# Altium schematic sheet SmartToy_FirstPage Board_REV01.SchDoc: Smart Toy First Page Board REV01 Schematic
size A4; DrawnBy: Manh Ngo Van; Engineer: Manh Ngo Van; Organization: Altium Limited; Address1: L3, 12a Rodborough Rd; Address2: Frenchs Forest; Address3: NSW; Address4: Australia 2086; DocumentNumber: 1; Revision: 1.0; SheetNumber: 1; SheetTotal: 1
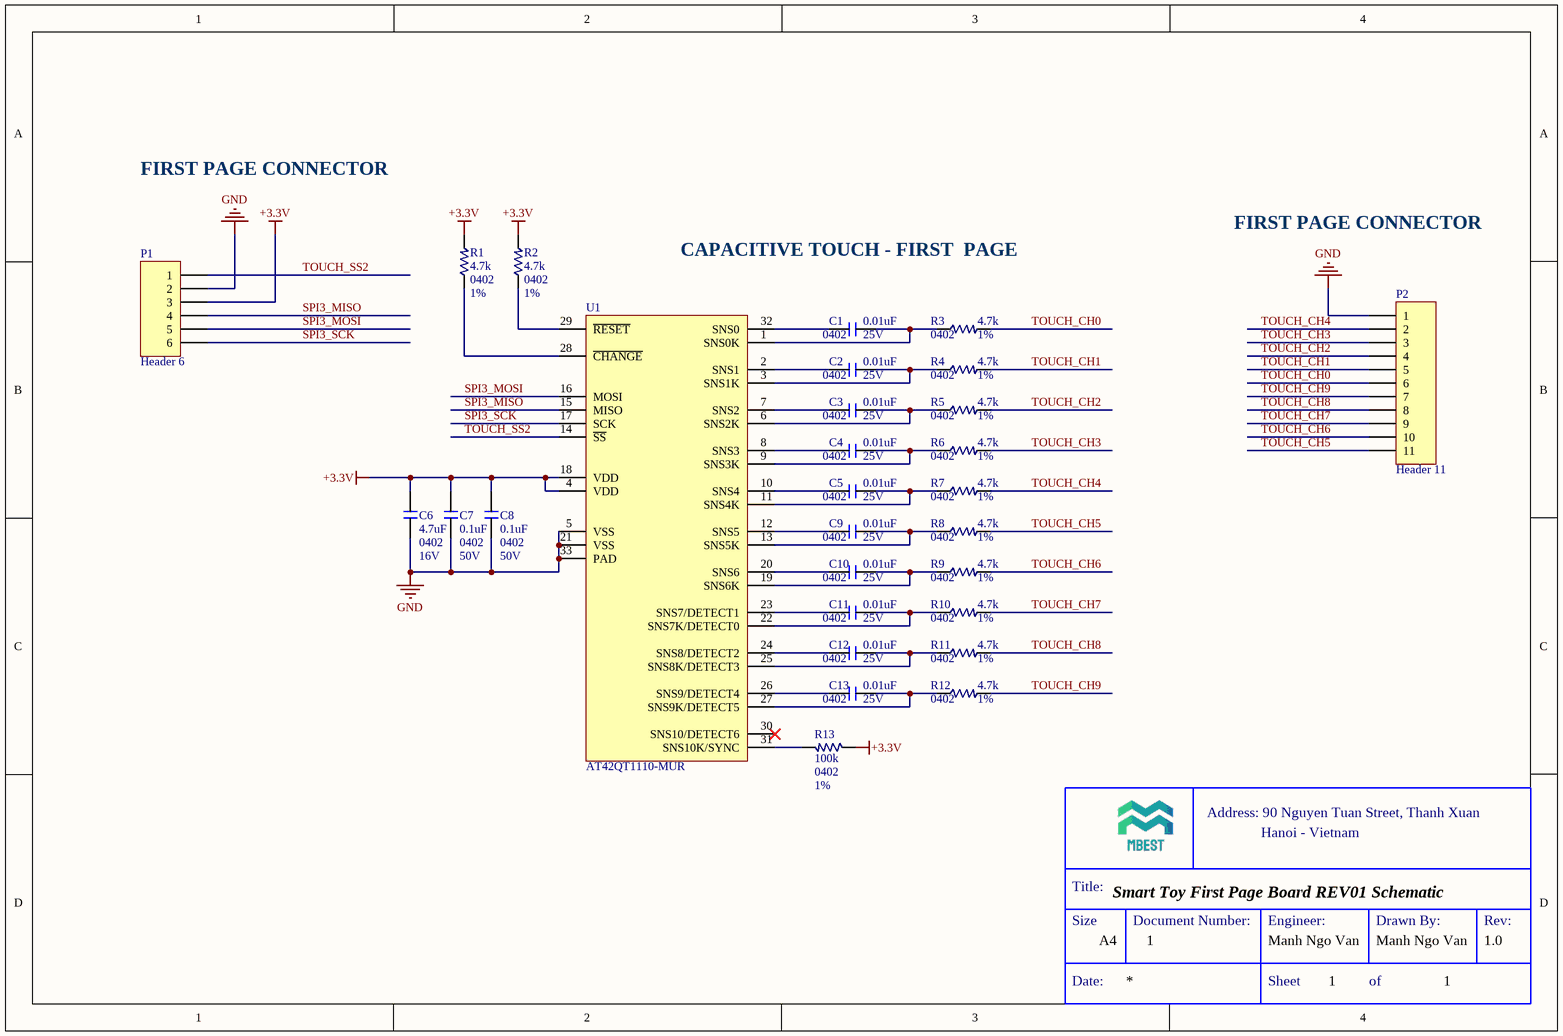
[diagram p0: SmartToy_FirstPage Board_REV01.SchDoc]

## Parts
C1  0.01uF  Case/Package: 0402  Voltage Rating: 25V  [C0402M]
C2  0.01uF  Case/Package: 0402  Voltage Rating: 25V  [C0402M]
C3  0.01uF  Case/Package: 0402  Voltage Rating: 25V  [C0402M]
C4  0.01uF  Case/Package: 0402  Voltage Rating: 25V  [C0402M]
C5  0.01uF  Case/Package: 0402  Voltage Rating: 25V  [C0402M]
C6  4.7uF  Case/Package: 0402  Voltage Rating: 16V  [C0402M]
C7  0.1uF  Case/Package: 0402  Voltage: 50V  [C0402M]
C8  0.1uF  Case/Package: 0402  Voltage: 50V  [C0402M]
C9  0.01uF  Case/Package: 0402  Voltage Rating: 25V  [C0402M]
C10  0.01uF  Case/Package: 0402  Voltage Rating: 25V  [C0402M]
C11  0.01uF  Case/Package: 0402  Voltage Rating: 25V  [C0402M]
C12  0.01uF  Case/Package: 0402  Voltage Rating: 25V  [C0402M]
C13  0.01uF  Case/Package: 0402  Voltage Rating: 25V  [C0402M]
P1  Header 6  [HDR1X6]
P2  Header 11  [TOUCH_CONTACT]  (no BOM)
R1  4.7k  Case Code (Imperial): 0402  Tolerance: 1%  [R0402M]
R2  4.7k  Case Code (Imperial): 0402  Tolerance: 1%  [R0402M]
R3  4.7k  Case Code (Imperial): 0402  Tolerance: 1%  [R0402M]
R4  4.7k  Case Code (Imperial): 0402  Tolerance: 1%  [R0402M]
R5  4.7k  Case Code (Imperial): 0402  Tolerance: 1%  [R0402M]
R6  4.7k  Case Code (Imperial): 0402  Tolerance: 1%  [R0402M]
R7  4.7k  Case Code (Imperial): 0402  Tolerance: 1%  [R0402M]
R8  4.7k  Case Code (Imperial): 0402  Tolerance: 1%  [R0402M]
R9  4.7k  Case Code (Imperial): 0402  Tolerance: 1%  [R0402M]
R10  4.7k  Case Code (Imperial): 0402  Tolerance: 1%  [R0402M]
R11  4.7k  Case Code (Imperial): 0402  Tolerance: 1%  [R0402M]
R12  4.7k  Case Code (Imperial): 0402  Tolerance: 1%  [R0402M]
R13  100k  Case Code (Imperial): 0402  Tolerance: 1%  [R0402M]
U1  AT42QT1110-MUR  [QFN50P500X500X100_HS-33N]

## Nets
+3.3V: C6.1 C7.1 C8.1 P1.3 R1.1 R2.1 R13.2 U1.4(VDD) U1.18(VDD)
GND: C6.2 C7.2 C8.2 P1.2 P2.1 U1.5(VSS) U1.21(VSS) U1.33(PAD)
SPI3_MISO: P1.4 U1.15(MISO)
SPI3_MOSI: P1.5 U1.16(MOSI)
SPI3_SCK: P1.6 U1.17(SCK)
TOUCH_CH0: P2.6 R3.1
TOUCH_CH1: P2.5 R4.1
TOUCH_CH2: P2.4 R5.1
TOUCH_CH3: P2.3 R6.1
TOUCH_CH4: P2.2 R7.1
TOUCH_CH5: P2.11 R8.1
TOUCH_CH6: P2.10 R9.1
TOUCH_CH7: P2.9 R10.1
TOUCH_CH8: P2.8 R11.1
TOUCH_CH9: P2.7 R12.1
TOUCH_SS2: P1.1 U1.14(~{SS})
NetC1_1: C1.1 R3.2 U1.1(SNS0K)
NetC1_2: C1.2 U1.32(SNS0)
NetC2_1: C2.1 R4.2 U1.3(SNS1K)
NetC2_2: C2.2 U1.2(SNS1)
NetC3_1: C3.1 R5.2 U1.6(SNS2K)
NetC3_2: C3.2 U1.7(SNS2)
NetC4_1: C4.1 R6.2 U1.9(SNS3K)
NetC4_2: C4.2 U1.8(SNS3)
NetC5_1: C5.1 R7.2 U1.11(SNS4K)
NetC5_2: C5.2 U1.10(SNS4)
NetC9_1: C9.1 R8.2 U1.13(SNS5K)
NetC9_2: C9.2 U1.12(SNS5)
NetC10_1: C10.1 R9.2 U1.19(SNS6K)
NetC10_2: C10.2 U1.20(SNS6)
NetC11_1: C11.1 R10.2 U1.22(SNS7K/DETECT0)
NetC11_2: C11.2 U1.23(SNS7/DETECT1)
NetC12_1: C12.1 R11.2 U1.25(SNS8K/DETECT3)
NetC12_2: C12.2 U1.24(SNS8/DETECT2)
NetC13_1: C13.1 R12.2 U1.27(SNS9K/DETECT5)
NetC13_2: C13.2 U1.26(SNS9/DETECT4)
NetR1_2: R1.2 U1.28(~{CHANGE})
NetR2_2: R2.2 U1.29(~{RESET})
NetR13_1: R13.1 U1.31(SNS10K/SYNC)

Not connected (* = marked no-connect by the designer): U1 30(SNS10/DETECT6)*

## Notes on the sheet
- FIRST PAGE CONNECTOR
- CAPACITIVE TOUCH - FIRST  PAGE
- Address: 90 Nguyen Tuan Street, Thanh Xuan
- Hanoi - Vietnam
- Title:
- Size
- Document Number:
- Engineer:
- Drawn By:
- Rev:
- Date:
- A4
- Sheet
- of

## Library data of the parts
C1-C5 C9-C13 = CAP_CER: CAP CER 10000PF 25V X7R 0402; Manufacturer: Samsung; Manufacturer Part Number: CL05B103KA5NNNC; Tolerance: 10%; Capacitance: 10nF; ComponentLink1URL: https://datasheet.ciiva.com/11586/upy-gphc-x7r-6-3v-to-50v-8-11586326.pdf?src-supplier=Avnet; ComponentLink1Description: https://datasheet.ciiva.com/11586/upy-gphc-x7r-6-3v-to-50v-8-11586326.pdf?src-supplier=Avnet; ComponentLink2URL: https://datasheet.ciiva.com/17434/upy-gphc-x7r-6-3v-to-50v-8-17434572.pdf?src-supplier=Avnet+Europe; ComponentLink2Description: https://datasheet.ciiva.com/17434/upy-gphc-x7r-6-3v-to-50v-8-17434572.pdf?src-supplier=Avnet+Europe; Supplier 1: Digi-Key; Supplier Part Number 1: 1276-1057-1-ND; Stock 1: 2714388; Pricing 1: 1 = 0.10000, 10 = 0.01800, 50 = 0.00960, 100 = 0.00780, 500 = 0.00558, 1000 = 0.00439, 2500 = 0.00399, 5000 = 0.00367 (USD); RoHS: Yes; Mount: Surface Mount; Case Code (Imperial): 0402; Case Code (Metric): 1005; Contact Plating: Tin; Min Operating Temperature: -55°C; Max Operating Temperature: 125°C; Dielectric: X7R; Packaging: Tape and Reel; Package Quantity: 1; Length: 1mm; Width: 0.02inch; Height: 0.5mm; Thickness: 0.022inch; Depth: 0.5mm; Radiation Hardening: No; ComponentLink3URL: https://datasheet.ciiva.com/15195/getdatasheetpartid-358612-15195635.pdf?src-supplier=Verical; ComponentLink3Description: https://datasheet.ciiva.com/15195/getdatasheetpartid-358612-15195635.pdf?src-supplier=Verical; ComponentLink4URL: https://datasheet.ciiva.com/16740/cl05b104kq5nnnc-16740683.pdf?src-supplier=Future+Electronics; ComponentLink4Description: https://datasheet.ciiva.com/16740/cl05b104kq5nnnc-16740683.pdf?src-supplier=Future+Electronics
C6 = CAP_CER: CAP CER 4.7UF 16V X5R 0402; Manufacturer: Samsung; Manufacturer Part Number: CL05A475MO5NUNC; Tolerance: 20%; ComponentLink1URL: https://datasheet.ciiva.com/25786/cl05a475mp5nrnc-25786963.pdf?src-supplier=Digi-Key; ComponentLink1Description: https://datasheet.ciiva.com/25786/cl05a475mp5nrnc-25786963.pdf?src-supplier=Digi-Key; ComponentLink2URL: https://datasheet.ciiva.com/16437/cl05b104kq5nnnc-16437353.pdf?src-supplier=Future+Electronics; ComponentLink2Description: https://datasheet.ciiva.com/16437/cl05b104kq5nnnc-16437353.pdf?src-supplier=Future+Electronics; Supplier 1: Digi-Key; Supplier Part Number 1: 1276-6836-6-ND; Stock 1: 1677309; Pricing 1: 1 = 0.45000, 10 = 0.32100, 100 = 0.21130, 500 = 0.15656, 1000 = 0.13307, 2500 = 0.12524, 5000 = 0.11741 (USD); RoHS: Yes; Mount: Surface Mount; Case Code (Imperial): 0402; Case Code (Metric): 1005; Min Operating Temperature: -55°C; Max Operating Temperature: 85°C; Packaging: Tape and Reel; Capacitance: 4.7uF; Length: 0.039inch; Width: 0.02inch; Thickness: 0.022inch; ComponentLink3URL: http://www.farnell.com/datasheets/2710653.pdf?src-supplier=Farnell; ComponentLink3Description: http://www.farnell.com/datasheets/2710653.pdf?src-supplier=Farnell; ComponentLink4URL: http://www.farnell.com/datasheets/2710653.pdf?src-supplier=Newark; ComponentLink4Description: http://www.farnell.com/datasheets/2710653.pdf?src-supplier=Newark; ComponentLink5URL: http://www.samsungsem.com/kr/support/product-search/mlcc/CL05A475MO5NUNC.jsp?src-supplier=Digi-Key; ComponentLink5Description: http://www.samsungsem.com/kr/support/product-search/mlcc/CL05A475MO5NUNC.jsp?src-supplier=Digi-Key
C7 C8 = CAP_CER: CAP CER 0.1UF 50V X7R 0402; Manufacturer: Murata; Manufacturer Part Number: GRM155R71H104KE14D; Material: Ceramic; Tolerance: 10%; Capacitance: 100nF; Dissipation Factor: 0.025%; ComponentLink1URL: https://datasheet.ciiva.com/25741/cl10b104kb8nnnl-25741341.pdf?src-supplier=Digi-Key; ComponentLink1Description: https://datasheet.ciiva.com/25741/cl10b104kb8nnnl-25741341.pdf?src-supplier=Digi-Key; ComponentLink2URL: https://datasheet.ciiva.com/26838/getdatasheetpartid-357523-26838415.pdf?src-supplier=Verical; ComponentLink2Description: https://datasheet.ciiva.com/26838/getdatasheetpartid-357523-26838415.pdf?src-supplier=Verical; Supplier 1: Digi-Key; Supplier Part Number 1: 490-10700-1-ND; Stock 1: 2282266; Pricing 1: 1 = 0.10000, 10 = 0.04600, 100 = 0.02050, 500 = 0.01464, 1000 = 0.01150, 2500 = 0.01045, 5000 = 0.00961 (USD); RoHS: Yes; Mount: Surface Mount; Weight: 0.000212oz; Case Code (Metric): 1005; Case Code (Imperial): 0402; Dielectric Material: Ceramic; Min Operating Temperature: -55°C; Max Operating Temperature: 125°C; Packaging: Tape and Reel; Dielectric: X7R; Voltage Rating: 50V; Termination: SMD/SMT; Composition: Ceramic; Voltage Rating (DC): 50V; Package Quantity: 10000; Length: 1mm; Height: 0.5mm; Width: 0.5mm; Thickness: 0.022inch; Depth: 0.5mm; REACH SVHC: No SVHC; Lead Free: Lead Free; ComponentLink3URL: http://www.farnell.com/datasheets/2079156.pdf?src-supplier=Farnell; ComponentLink3Description: http://www.farnell.com/datasheets/2079156.pdf?src-supplier=Farnell; ComponentLink4URL: http://www.mouser.com/ds/2/281/c02e-2905.pdf?src-supplier=Mouser; ComponentLink4Description: http://www.mouser.com/ds/2/281/c02e-2905.pdf?src-supplier=Mouser; ComponentLink5URL: http://components.arrow.com/part/dataview/0323_07030614?src-supplier=Arrow+Europe; ComponentLink5Description: http://components.arrow.com/part/dataview/0323_07030614?src-supplier=Arrow+Europe; ComponentLink6URL: https://search.murata.co.jp/Ceramy/image/img/A01X/G101/ENG/GRM155R71H104KE14-01.pdf?src-supplier=Digi-Key; ComponentLink6Description: https://search.murata.co.jp/Ceramy/image/img/A01X/G101/ENG/GRM155R71H104KE14-01.pdf?src-supplier=Digi-Key; ComponentLink7URL: http://psearch.en.murata.com/capacitor/product/GRM155R71H104KE14%23.pdf?src-supplier=Avnet; ComponentLink7Description: http://psearch.en.murata.com/capacitor/product/GRM155R71H104KE14%23.pdf?src-supplier=Avnet; ComponentLink8URL: http://www.farnell.com/datasheets/2079156.pdf?src-supplier=Element14; ComponentLink8Description: http://www.farnell.com/datasheets/2079156.pdf?src-supplier=Element14; ComponentLink9URL: http://www.farnell.com/datasheets/2079156.pdf?src-supplier=Newark; ComponentLink9Description: http://www.farnell.com/datasheets/2079156.pdf?src-supplier=Newark
P1 = Header 6: Header, 6-Pin; LatestRevisionDate: 17-Jul-2002; LatestRevisionNote: Re-released for DXP Platform.; Publisher: Altium Limited
P2 = Header 11: Header, 11-Pin; LatestRevisionDate: 17-Jul-2002; LatestRevisionNote: Re-released for DXP Platform.; Publisher: Altium Limited
R1-R12 = RES_SMD: RES SMD 4.7K OHM 1% 1/16W 0402; Manufacturer: Yageo; Manufacturer Part Number: RC0402FR-074K7L; Voltage Rating (DC): 50V; Power Rating: 62.5mW; Resistance: 4.7kR; Temperature Coefficient: 100ppm/°C; Supplier 1: Digi-Key; Supplier Part Number 1: 311-4.7KLRCT-ND; Stock 1: 10584879; Pricing 1: 1 = 0.10000, 10 = 0.01400, 100 = 0.00580, 1000 = 0.00260, 2500 = 0.00226, 5000 = 0.00186 (USD); RoHS: Yes; Case/Package: 0402; Number of Pins: 2; Case Code (Metric): 1005; Min Operating Temperature: -55°C; Max Operating Temperature: 155°C; Voltage Rating: 50V; Packaging: Tape and Reel; Resistor Type: Thick Film; Termination: SMD/SMT; Length: 1mm; Width: 0.5mm; Height: 0.32mm; Depth: 0.5mm; REACH SVHC: No SVHC; Military Standard: Not; Lead Free: Lead Free; ComponentLink1URL: https://datasheet.ciiva.com/7850/1018594-7850022.pdf?src-supplier=Element14; ComponentLink1Description: https://datasheet.ciiva.com/7850/1018594-7850022.pdf?src-supplier=Element14; ComponentLink2URL: https://datasheet.ciiva.com/7850/1018594-7850023.pdf?src-supplier=Element14; ComponentLink2Description: https://datasheet.ciiva.com/7850/1018594-7850023.pdf?src-supplier=Element14; ComponentLink3URL: https://datasheet.ciiva.com/15215/getdatasheetpartid-328119-15215035.pdf?src-supplier=Verical; ComponentLink3Description: https://datasheet.ciiva.com/15215/getdatasheetpartid-328119-15215035.pdf?src-supplier=Verical; ComponentLink4URL: https://datasheet.ciiva.com/22661/1686128-22661342.pdf?src-supplier=Element14; ComponentLink4Description: https://datasheet.ciiva.com/22661/1686128-22661342.pdf?src-supplier=Element14
R13 = RES_SMD: RES SMD 100K OHM 1% 1/16W 0402; Manufacturer: Yageo; Manufacturer Part Number: RC0402FR-07100KL; Resistance: 100kR; Power Rating: 63mW; Voltage Rating: 50V; Temperature Coefficient: 100ppm/°C; ComponentLink1URL: https://datasheet.ciiva.com/11808/0900766b80f96399-11808107.pdf?src-supplier=RSComponents; ComponentLink1Description: https://datasheet.ciiva.com/11808/0900766b80f96399-11808107.pdf?src-supplier=RSComponents; ComponentLink2URL: https://datasheet.ciiva.com/7983/443971-7983593.pdf?src-supplier=Element14; ComponentLink2Description: https://datasheet.ciiva.com/7983/443971-7983593.pdf?src-supplier=Element14; ComponentLink3URL: https://datasheet.ciiva.com/46440/1868787-46440889.pdf?src-supplier=Element14; ComponentLink3Description: https://datasheet.ciiva.com/46440/1868787-46440889.pdf?src-supplier=Element14; ComponentLink4URL: https://datasheet.ciiva.com/7746/1738695-7746234.pdf?src-supplier=Element14; ComponentLink4Description: https://datasheet.ciiva.com/7746/1738695-7746234.pdf?src-supplier=Element14; ComponentLink5URL: https://datasheet.ciiva.com/7746/1738695-7746235.pdf?src-supplier=Element14; ComponentLink5Description: https://datasheet.ciiva.com/7746/1738695-7746235.pdf?src-supplier=Element14; ComponentLink6URL: https://datasheet.ciiva.com/22747/443971-22747516.pdf?src-supplier=Element14; ComponentLink6Description: https://datasheet.ciiva.com/22747/443971-22747516.pdf?src-supplier=Element14; Supplier 1: Digi-Key; Supplier Part Number 1: 311-100KJRCT-ND; Stock 1: 3850330; Pricing 1: 1 = 0.10000, 10 = 0.01200, 100 = 0.00480, 1000 = 0.00215, 2500 = 0.00186, 5000 = 0.00154 (USD); RoHS: Yes; Case/Package: 0402; Case Code (Metric): 1005; Min Operating Temperature: -55°C; Max Operating Temperature: 155°C; Packaging: Tape and Reel; Package Quantity: 1; Resistor Type: Thick Film; Number of Terminations: 2; Termination: SMD/SMT; Max Power Dissipation: 63mW; Features: Moisture Resistant; Length: 1mm; Width: 0.02inch; Height: 0.016inch; Depth: 0.5mm; REACH SVHC: Unknown; Military Standard: Not; Lead Free: Lead Free; ComponentLink7URL: https://datasheet.ciiva.com/7850/1018594-7850133.pdf?src-supplier=Element14; ComponentLink7Description: https://datasheet.ciiva.com/7850/1018594-7850133.pdf?src-supplier=Element14; ComponentLink8URL: https://datasheet.ciiva.com/2491/pyu-r-int-thick-7-2491207.pdf?src-supplier=Digi-Key; ComponentLink8Description: https://datasheet.ciiva.com/2491/pyu-r-int-thick-7-2491207.pdf?src-supplier=Digi-Key; ComponentLink9URL: https://datasheet.ciiva.com/2491/pyu-r-int-thick-7-2491208.pdf?src-supplier=Digi-Key; ComponentLink9Description: https://datasheet.ciiva.com/2491/pyu-r-int-thick-7-2491208.pdf?src-supplier=Digi-Key; ComponentLink10URL: https://datasheet.ciiva.com/2491/pyu-r-int-thick-7-2491209.pdf?src-supplier=Digi-Key; ComponentLink10Description: https://datasheet.ciiva.com/2491/pyu-r-int-thick-7-2491209.pdf?src-supplier=Digi-Key; ComponentLink11URL: https://datasheet.ciiva.com/17052/pyu-rc0402-51-rohs-l-6-r-17052137.pdf?src-supplier=Future+Electronics; ComponentLink11Description: https://datasheet.ciiva.com/17052/pyu-rc0402-51-rohs-l-6-r-17052137.pdf?src-supplier=Future+Electronics; ComponentLink12URL: https://datasheet.ciiva.com/12668/pyu-rc0402-51-rohs-l-6-r-12668218.pdf?src-supplier=Mouser; ComponentLink12Description: https://datasheet.ciiva.com/12668/pyu-rc0402-51-rohs-l-6-r-12668218.pdf?src-supplier=Mouser; ComponentLink13URL: https://datasheet.ciiva.com/46394/1018594-46394941.pdf?src-supplier=Element14; ComponentLink13Description: https://datasheet.ciiva.com/46394/1018594-46394941.pdf?src-supplier=Element14
U1 = AT42QT1110-MUR: Capacitive Touch Screen 11 Key 32-Pin VQFN EP T/R; Manufacturer 1: Microchip; Supplier 1: Digi-Key; Manufacturer Part Number 1: AT42QT1110-MUR; RoHS: No; Stock 1: 4052; Pricing 1: 1=1.16000, 25=1.06000, 100=0.96200 (USD); ComponentLink1URL: http://www.microchip.com/mymicrochip/filehandler.aspx?ddocname=en590256&src-supplier=Digi-Key; ComponentLink1Description: http://www.microchip.com/mymicrochip/filehandler.aspx?ddocname=en590256&src-supplier=Digi-Key; Supplier Part Number 1: AT42QT1110-MURCT-ND